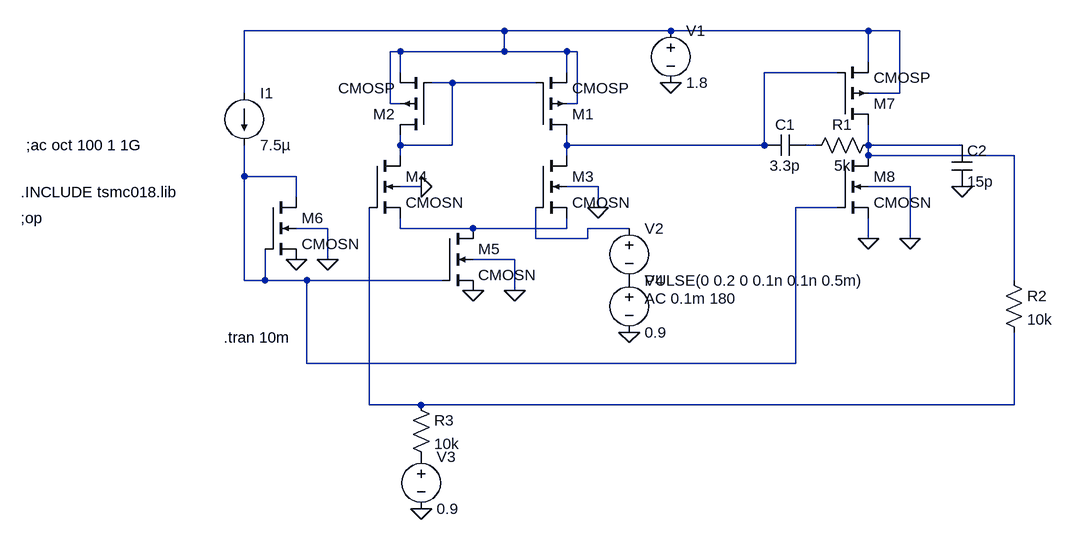
[diagram p0: schematic ArkapravaPaul_230108071 - ClosedLoop.asc]
ArkapravaPaul_230108071 - ClosedLoop.asc, the LTspice schematic file:
Version 4
SHEET 1 1092 724
WIRE 240 -32 -160 -32
WIRE 496 -32 240 -32
WIRE 800 -32 496 -32
WIRE 848 -32 800 -32
WIRE 80 0 64 0
WIRE 240 0 240 -32
WIRE 240 0 80 0
WIRE 336 0 240 0
WIRE 352 0 336 0
WIRE 800 16 800 -32
WIRE 80 32 80 0
WIRE 336 32 336 0
WIRE 752 32 640 32
WIRE 160 48 128 48
WIRE 288 48 160 48
WIRE -160 64 -160 -32
WIRE 848 64 848 -32
WIRE 848 64 800 64
WIRE 64 80 64 0
WIRE 80 80 64 80
WIRE 352 80 352 0
WIRE 352 80 336 80
WIRE 80 144 80 128
WIRE 160 144 160 48
WIRE 160 144 80 144
WIRE 336 144 336 128
WIRE 640 144 640 32
WIRE 640 144 336 144
WIRE 720 144 704 144
WIRE 800 144 800 112
WIRE 944 144 800 144
WIRE 80 160 80 144
WIRE 336 160 336 144
WIRE 800 160 800 144
WIRE 1024 160 800 160
WIRE -160 192 -160 144
WIRE -80 192 -160 192
WIRE 112 208 80 208
WIRE 384 208 336 208
WIRE 864 208 800 208
WIRE -80 224 -80 192
WIRE 384 240 384 208
WIRE 752 240 688 240
WIRE -32 272 -80 272
WIRE 80 272 80 256
WIRE 192 272 80 272
WIRE 336 272 336 256
WIRE 336 272 192 272
WIRE 432 272 368 272
WIRE 288 288 288 240
WIRE 368 288 368 272
WIRE 368 288 288 288
WIRE 800 288 800 256
WIRE 864 288 864 208
WIRE -32 320 -32 272
WIRE 256 320 192 320
WIRE -160 352 -160 192
WIRE -128 352 -128 304
WIRE -128 352 -160 352
WIRE -64 352 -128 352
WIRE 144 352 -64 352
WIRE 1024 352 1024 160
WIRE 256 368 256 320
WIRE -64 480 -64 352
WIRE 688 480 688 240
WIRE 688 480 -64 480
WIRE 32 544 32 240
WIRE 112 544 32 544
WIRE 1024 544 1024 432
WIRE 1024 544 112 544
FLAG 384 240 0
FLAG 112 208 0
FLAG 192 368 0
FLAG -80 320 0
FLAG -32 320 0
FLAG 256 368 0
FLAG 496 48 0
FLAG 800 288 0
FLAG 864 288 0
FLAG 944 208 0
FLAG 112 704 0
FLAG 432 432 0
SYMBOL cmosp 288 128 M180
SYMATTR InstName M1
SYMATTR Value2 l=1u w=55u
SYMBOL cmosp 128 128 R180
SYMATTR InstName M2
SYMATTR Value2 l=1u w=55u
SYMBOL cmosn 288 160 R0
SYMATTR InstName M3
SYMATTR Value2 l=1u w=32u
SYMBOL cmosn 32 160 R0
SYMATTR InstName M4
SYMATTR Value2 l=1u w=32u
SYMBOL cmosn 144 272 R0
SYMATTR InstName M5
SYMATTR Value2 l=1u w=39u
SYMBOL cmosn -128 224 R0
SYMATTR InstName M6
SYMATTR Value2 l=1u w=4u
SYMBOL voltage 496 -48 R0
WINDOW 123 0 0 Left 2
WINDOW 39 0 0 Left 2
SYMATTR InstName V1
SYMATTR Value 1.8
SYMBOL voltage 432 256 R0
WINDOW 123 24 124 Left 2
WINDOW 39 0 0 Left 2
SYMATTR Value2 AC 0.1m 180
SYMATTR InstName V2
SYMATTR Value PULSE(0 0.2 0 0.1n 0.1n 0.5m)
SYMBOL current -160 64 R0
WINDOW 123 0 0 Left 2
WINDOW 39 0 0 Left 2
SYMATTR InstName I1
SYMATTR Value 7.5µ
SYMBOL cmosp 752 112 M180
SYMATTR InstName M7
SYMATTR Value2 l=0.18u w=16u
SYMBOL cmosn 752 160 R0
SYMATTR InstName M8
SYMATTR Value2 l=0.18u w=3.5u
SYMBOL cap 704 128 R90
WINDOW 0 0 32 VBottom 2
WINDOW 3 32 32 VTop 2
SYMATTR InstName C1
SYMATTR Value 3.3p
SYMBOL res 816 128 R90
WINDOW 0 0 56 VBottom 2
WINDOW 3 32 56 VTop 2
SYMATTR InstName R1
SYMATTR Value 5k
SYMBOL cap 928 144 R0
SYMATTR InstName C2
SYMATTR Value 15p
SYMBOL res 1008 336 R0
SYMATTR InstName R2
SYMATTR Value 10k
SYMBOL res 96 528 R0
SYMATTR InstName R3
SYMATTR Value 10k
SYMBOL voltage 112 608 R0
WINDOW 123 0 0 Left 2
WINDOW 39 0 0 Left 2
SYMATTR InstName V3
SYMATTR Value 0.9
SYMBOL voltage 432 336 R0
WINDOW 123 0 0 Left 2
WINDOW 39 0 0 Left 2
SYMATTR InstName V4
SYMATTR Value 0.9
TEXT -192 440 Left 2 !.tran 10m
TEXT -504 216 Left 2 !.INCLUDE tsmc018.lib
TEXT -504 256 Left 2 !;op
TEXT -496 144 Left 2 !;ac oct 100 1 1G

The netlist it stands for:
* ArkapravaPaul_230108071 - ClosedLoop.asc
M1 N002 N003 N001 N001 CMOSP l=1u w=55u
M2 N003 N003 N001 N001 CMOSP l=1u w=55u
M3 N002 N008 N007 0 CMOSN l=1u w=32u
M4 N003 N009 N007 0 CMOSN l=1u w=32u
M5 N007 N006 0 0 CMOSN l=1u w=39u
M6 N006 N006 0 0 CMOSN l=1u w=4u
V1 N001 0 1.8
V2 N008 P001 PULSE(0 0.2 0 0.1n 0.1n 0.5m) AC 0.1m 180
I1 N001 N006 7.5µ
M7 N005 N002 N001 N001 CMOSP l=0.18u w=16u
M8 N005 N006 0 0 CMOSN l=0.18u w=3.5u
C1 N004 N002 3.3p
R1 N005 N004 5k
C2 N005 0 15p
R2 N005 N009 10k
R3 N009 P002 10k
V3 P002 0 0.9
V4 P001 0 0.9
.model NMOS NMOS
.model PMOS PMOS
.lib standard.mos
.tran 10m
.INCLUDE tsmc018.lib
;op
;ac oct 100 1 1G
.backanno
.end